# EAGLE design pixhawk (EAGLE 8.6.0)

## Sheet 1 of 2
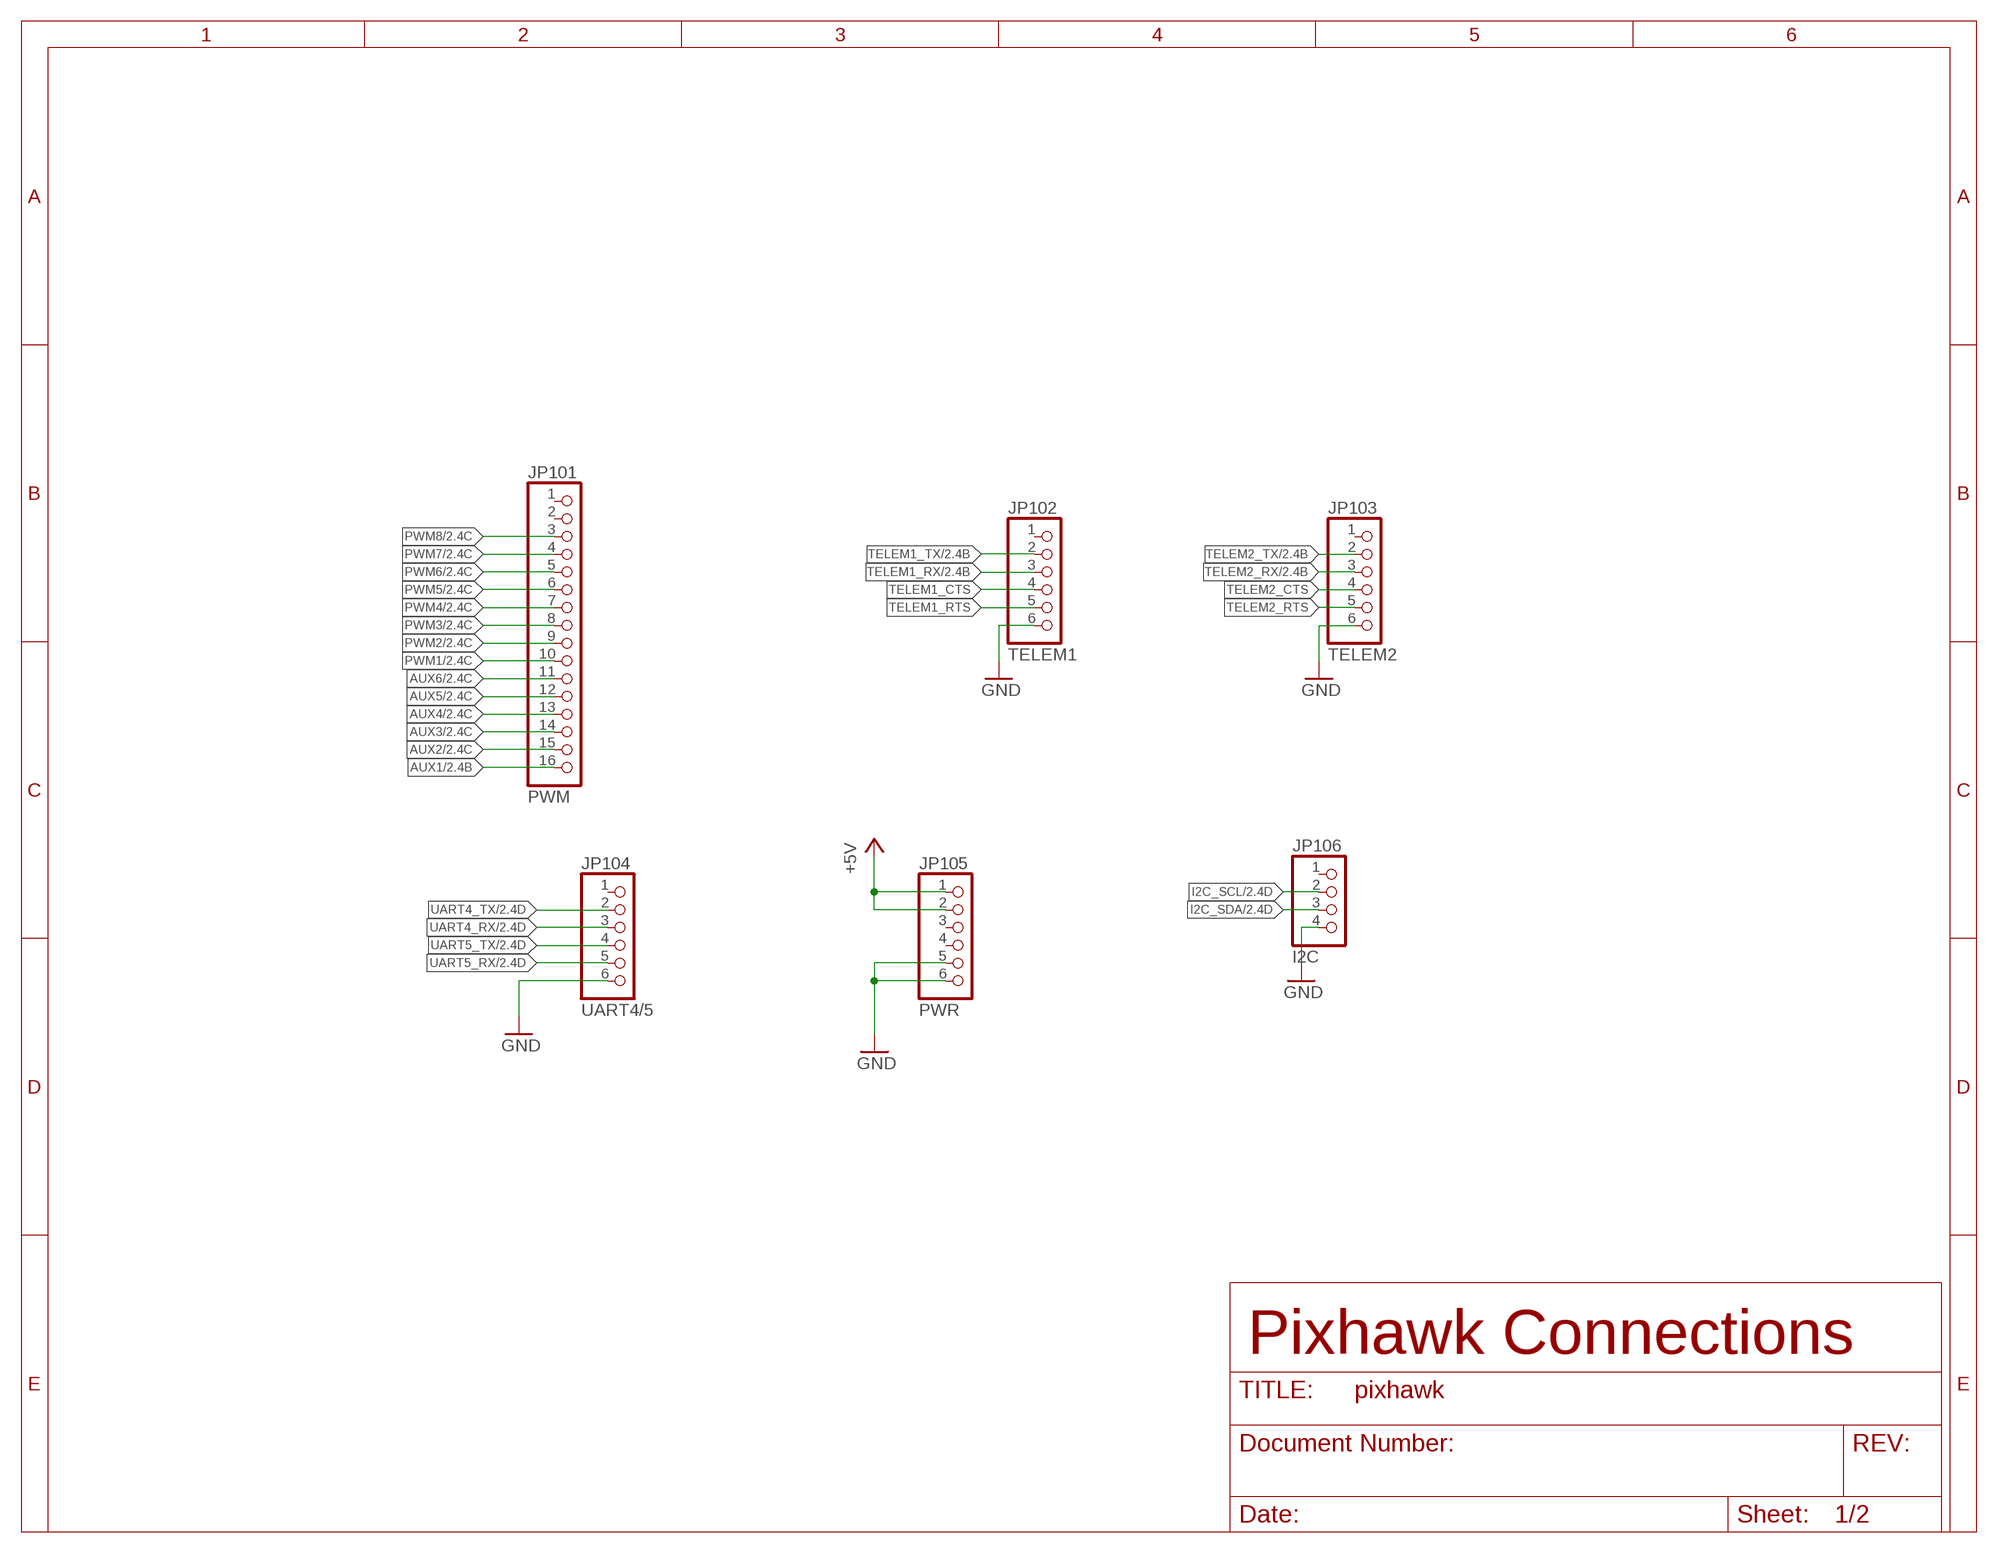
[diagram p0: schematic, sheet 1]

### Parts
JP101  PWM  PINHD-1X16  [1X16]
JP102  TELEM1  PINHD-1X6  [1X06]
JP103  TELEM2  PINHD-1X6  [1X06]
JP104  UART4/5  PINHD-1X6  [1X06]
JP105  PWR  PINHD-1X6  [1X06]
JP106  I2C  PINHD-1X4  [1X04]

### Nets
+5V: JP105.1 JP105.2 ; also sheet 2
AUX1: JP101.16 ; also sheet 2
AUX2: JP101.15 ; also sheet 2
AUX3: JP101.14 ; also sheet 2
AUX4: JP101.13 ; also sheet 2
AUX5: JP101.12 ; also sheet 2
AUX6: JP101.11 ; also sheet 2
GND: JP102.6 JP103.6 JP104.6 JP105.5 JP105.6 JP106.4 ; also sheet 2
I2C_SCL: JP106.2 ; also sheet 2
I2C_SDA: JP106.3 ; also sheet 2
PWM1: JP101.10 ; also sheet 2
PWM2: JP101.9 ; also sheet 2
PWM3: JP101.8 ; also sheet 2
PWM4: JP101.7 ; also sheet 2
PWM5: JP101.6 ; also sheet 2
PWM6: JP101.5 ; also sheet 2
PWM7: JP101.4 ; also sheet 2
PWM8: JP101.3 ; also sheet 2
TELEM1_CTS: JP102.4
TELEM1_RTS: JP102.5
TELEM1_RX: JP102.3 ; also sheet 2
TELEM1_TX: JP102.2 ; also sheet 2
TELEM2_CTS: JP103.4
TELEM2_RTS: JP103.5
TELEM2_RX: JP103.3 ; also sheet 2
TELEM2_TX: JP103.2 ; also sheet 2
UART4_RX: JP104.3 ; also sheet 2
UART4_TX: JP104.2 ; also sheet 2
UART5_RX: JP104.5 ; also sheet 2
UART5_TX: JP104.4 ; also sheet 2
Unconnected: JP101.1 JP101.2 JP102.1 JP103.1 JP104.1 JP105.3 JP105.4 JP106.1

### Notes on the sheet
- Pixhawk Connections

## Sheet 2 of 2
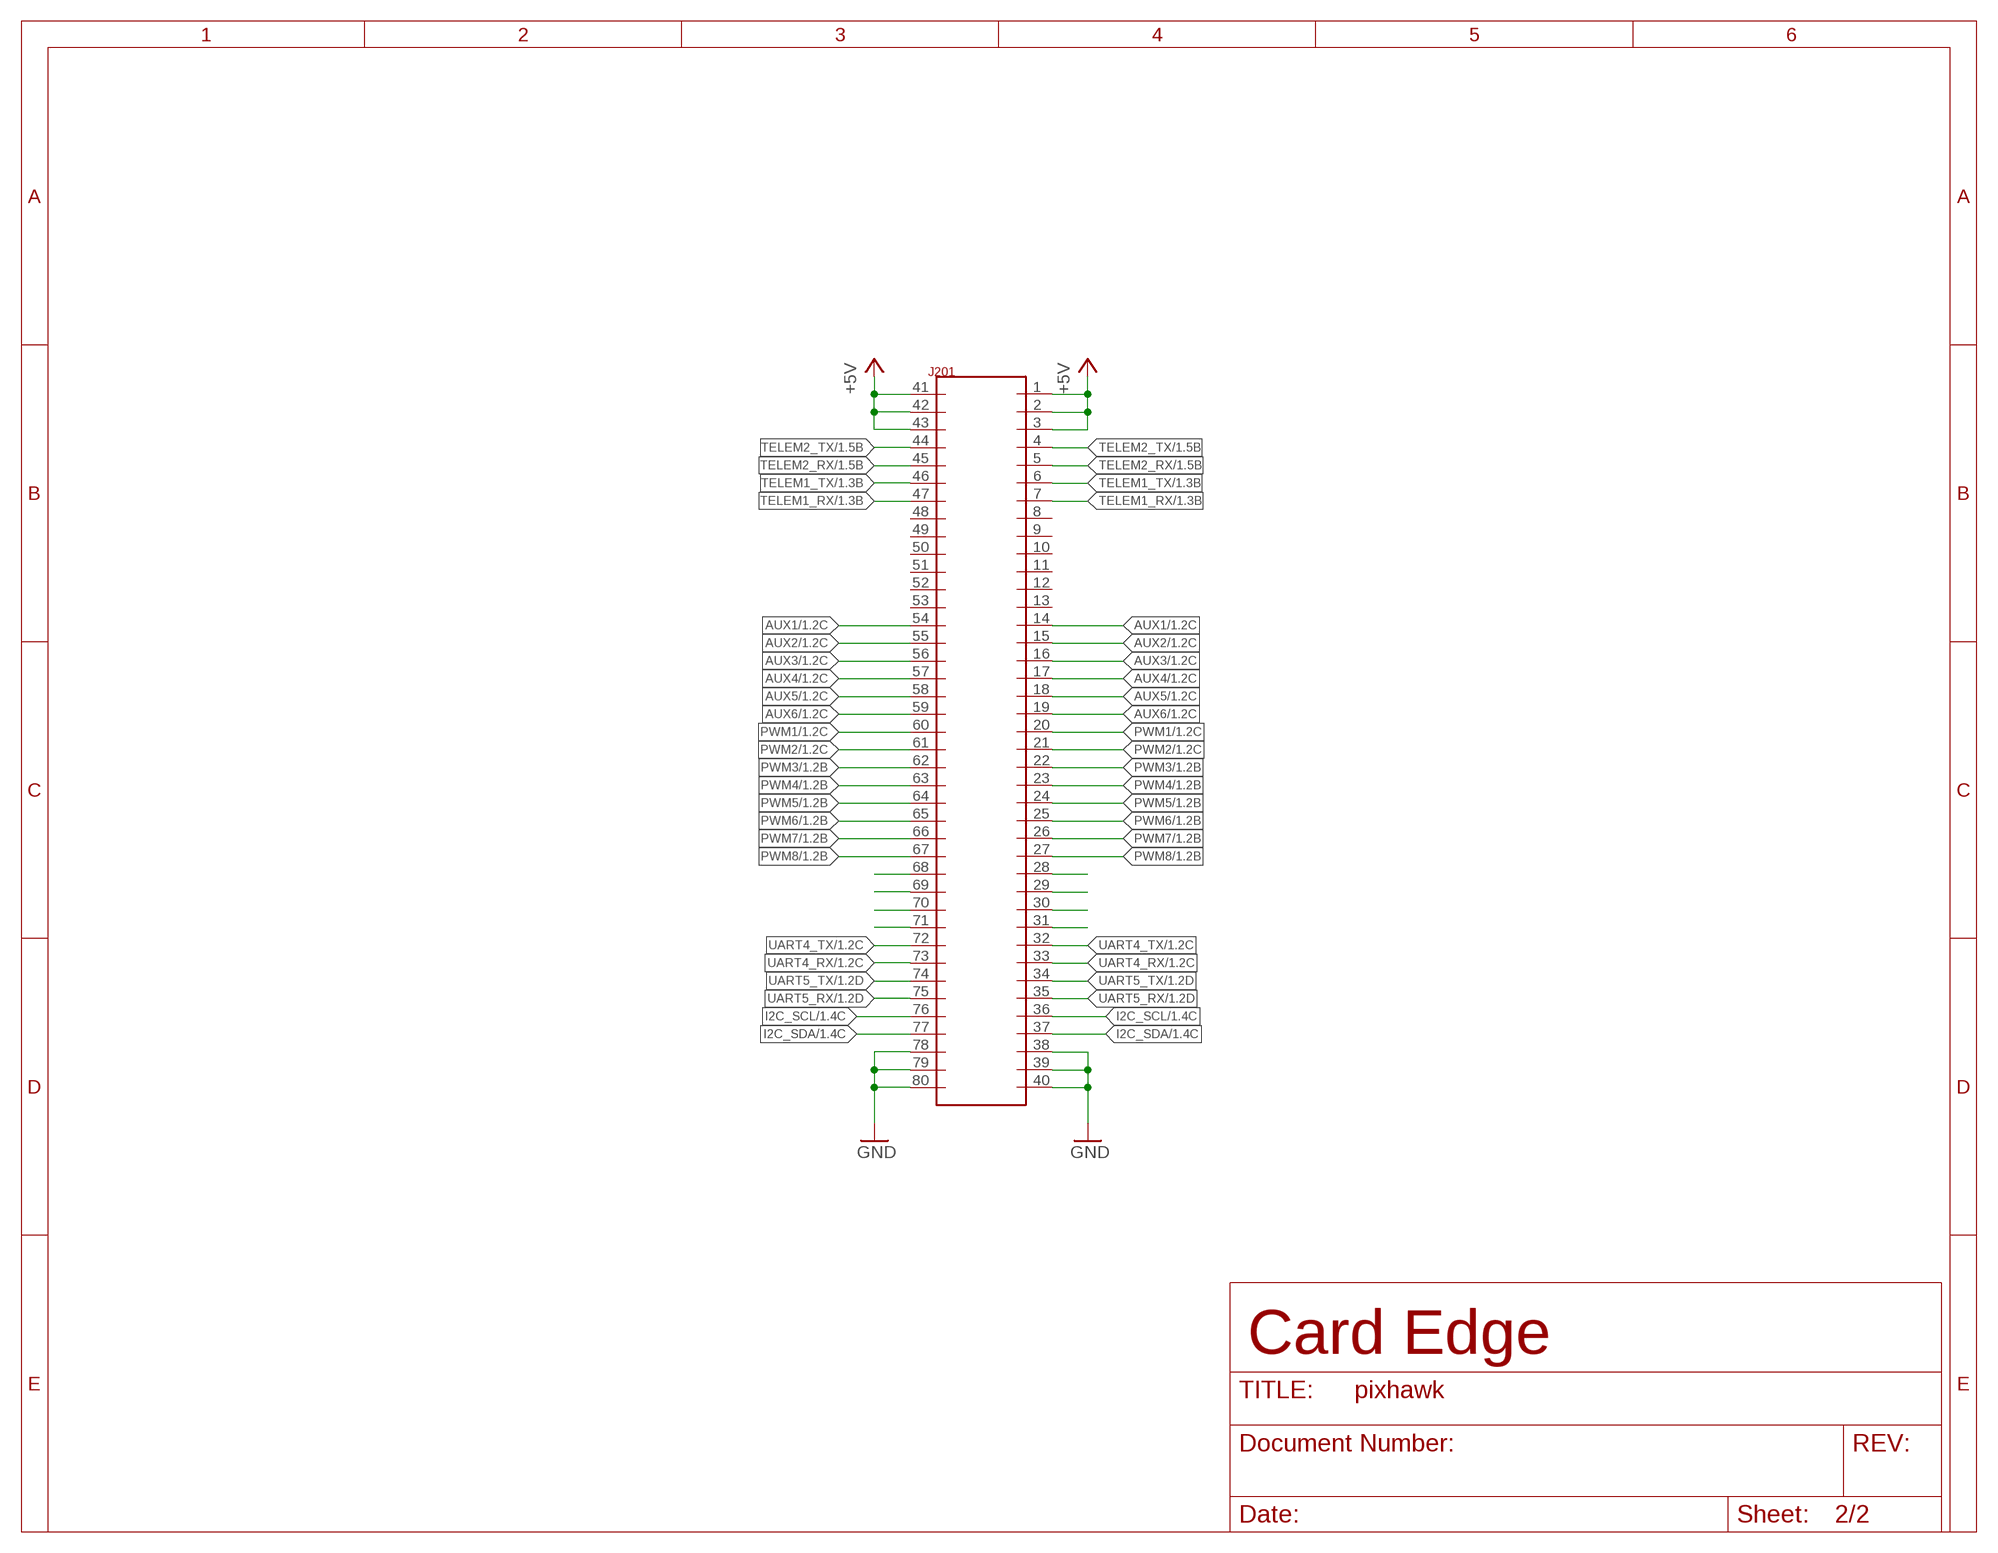
[diagram p1: schematic, sheet 2]

### Parts
J201  80-PIN-CARD-EDGE  [80-PIN-CARD-EDGE]

### Nets
+5V: J201.1 J201.2 J201.3 J201.41 J201.42 J201.43 ; also sheet 1
AUX1: J201.14 J201.54 ; also sheet 1
AUX2: J201.15 J201.55 ; also sheet 1
AUX3: J201.16 J201.56 ; also sheet 1
AUX4: J201.17 J201.57 ; also sheet 1
AUX5: J201.18 J201.58 ; also sheet 1
AUX6: J201.19 J201.59 ; also sheet 1
CAN_H: J201.30 J201.70
CAN_L: J201.31 J201.71
GND: J201.38 J201.39 J201.40 J201.78 J201.79 J201.80 ; also sheet 1
I2C_SCL: J201.36 J201.76 ; also sheet 1
I2C_SDA: J201.37 J201.77 ; also sheet 1
N$11: J201.28
N$12: J201.29
N$25: J201.69
N$26: J201.68
PWM1: J201.20 J201.60 ; also sheet 1
PWM2: J201.21 J201.61 ; also sheet 1
PWM3: J201.22 J201.62 ; also sheet 1
PWM4: J201.23 J201.63 ; also sheet 1
PWM5: J201.24 J201.64 ; also sheet 1
PWM6: J201.25 J201.65 ; also sheet 1
PWM7: J201.26 J201.66 ; also sheet 1
PWM8: J201.27 J201.67 ; also sheet 1
TELEM1_RX: J201.7 J201.47 ; also sheet 1
TELEM1_TX: J201.6 J201.46 ; also sheet 1
TELEM2_RX: J201.5 J201.45 ; also sheet 1
TELEM2_TX: J201.4 J201.44 ; also sheet 1
UART4_RX: J201.33 J201.73 ; also sheet 1
UART4_TX: J201.32 J201.72 ; also sheet 1
UART5_RX: J201.35 J201.75 ; also sheet 1
UART5_TX: J201.34 J201.74 ; also sheet 1
Unconnected: J201.8 J201.9 J201.10 J201.11 J201.12 J201.13 J201.48 J201.49 J201.50 J201.51 J201.52 J201.53

### Notes on the sheet
- Card Edge

## Library data of the parts
J201 = auv:80-PIN-CARD-EDGE
JP101 = auv:PINHD-1X16: PIN HEADER
JP102-JP105 = auv:PINHD-1X6: PIN HEADER
JP106 = auv:PINHD-1X4: PIN HEADER

## Board
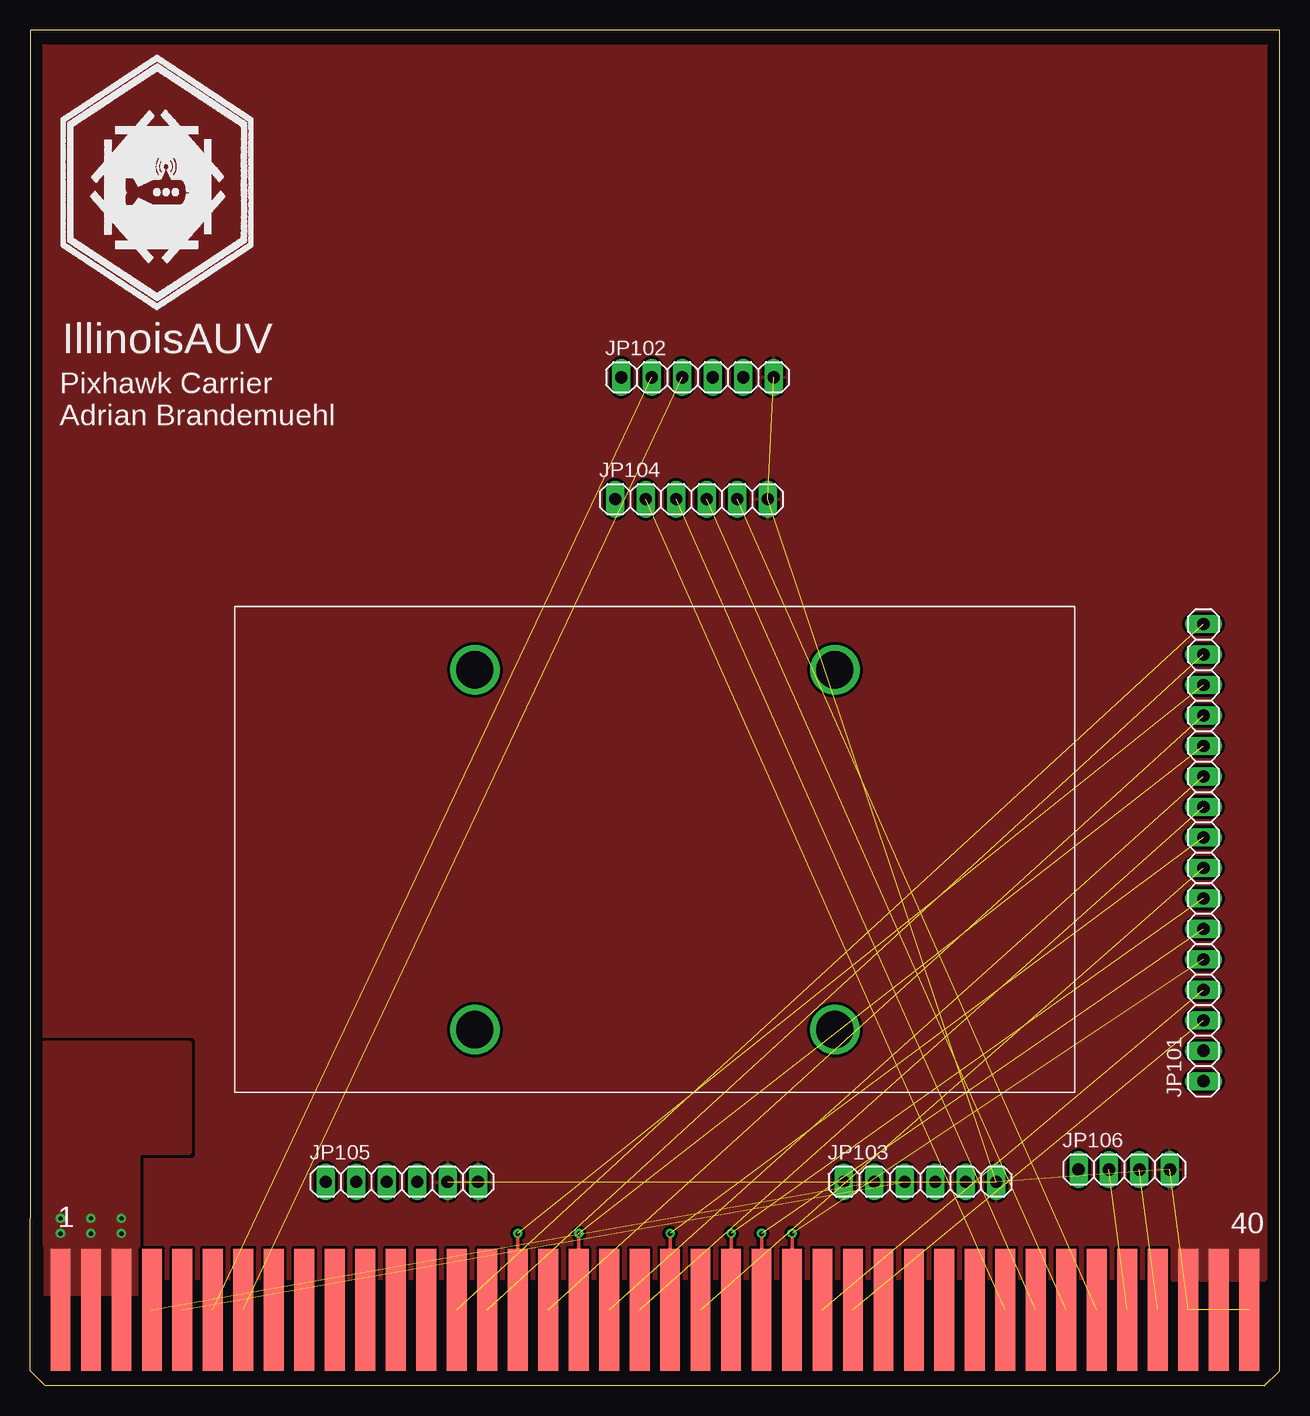
[diagram p2: board, top side]
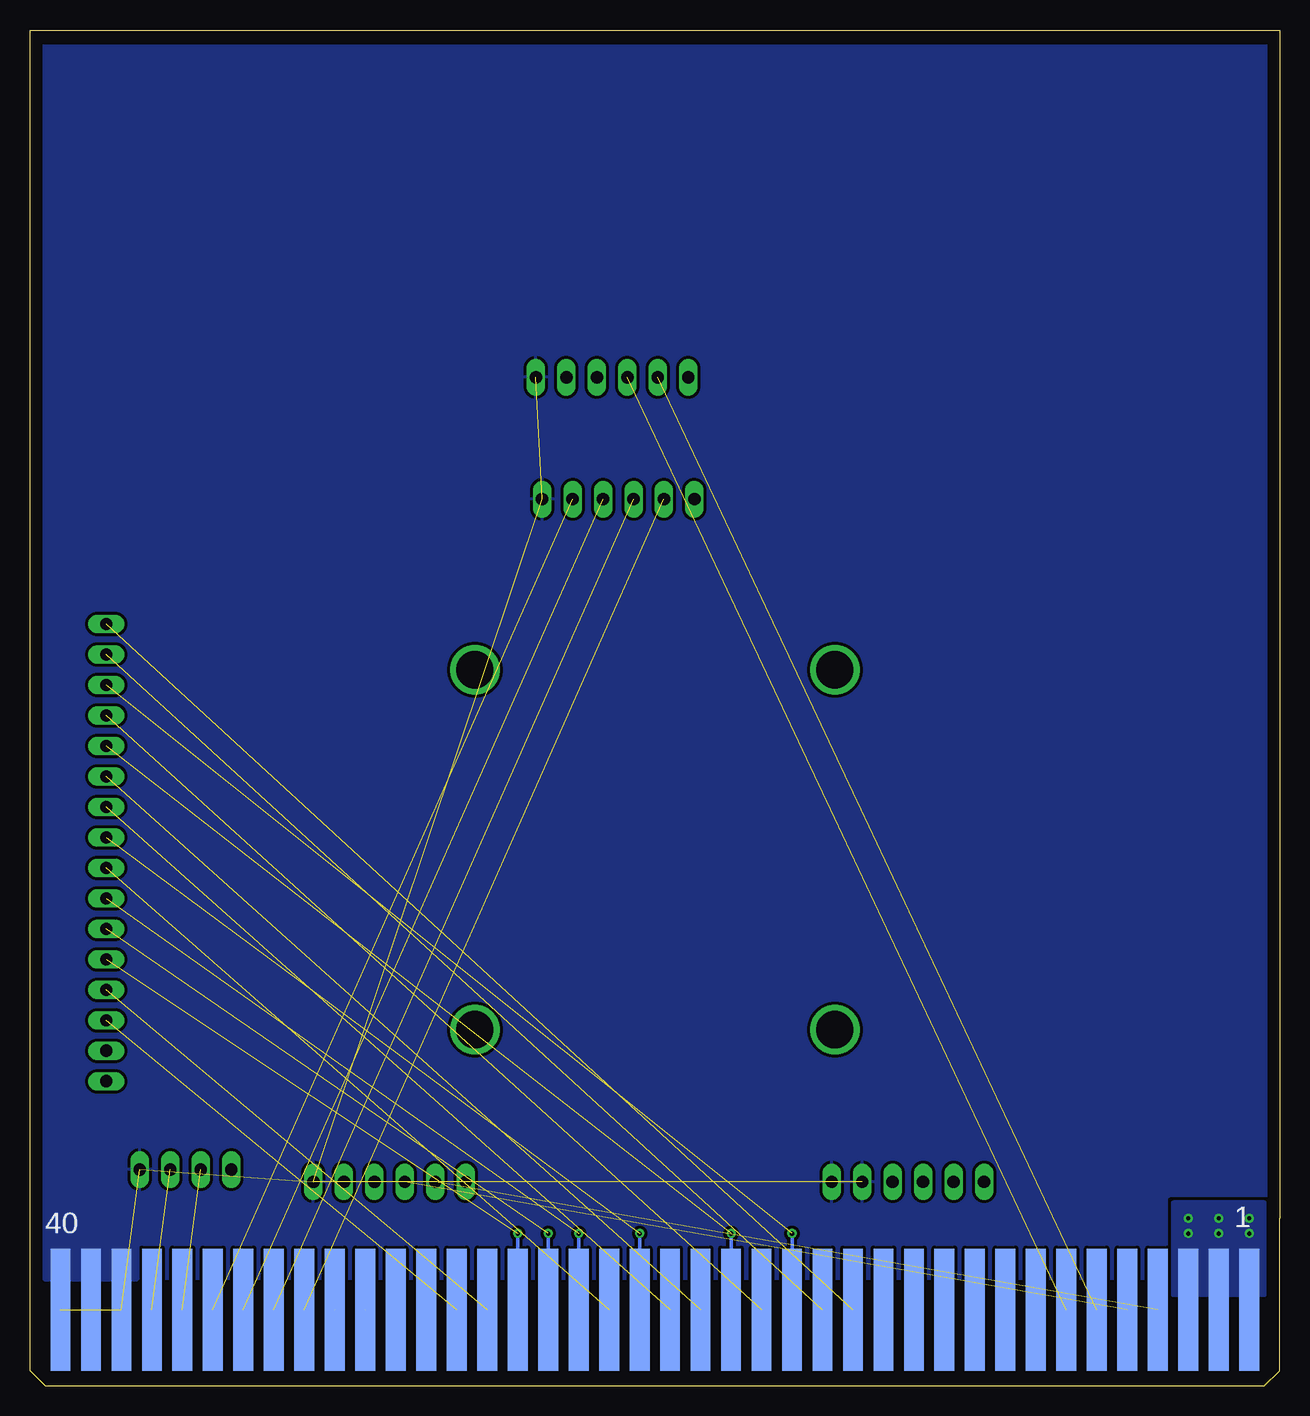
[diagram p3: board, bottom side, seen from below]

Size 104.14 x 113.03 mm. Coordinates in mm from the lower left corner, seen from the top.
Outline: 104.14,13.97 104.14,113.03 0,113.03 0,13.97
Copper layers (1*16): Top 0.035mm / dielectric 1.5mm / Bottom 0.035mm
Design rules "PCBway": minimum track width 6mil, minimum drill 0.3mm, track to track 0.205mm, track to pad 0.205mm, pad to pad 0.205mm, via to via 0.205mm, smd to smd 8mil, copper to edge 40mil, drill to drill 8mil, minimum pad ring 10mil, minimum via ring 8mil, stop-mask expansion 4mil, vias tented up to drill 25mil, thermal gap 10mil

### Footprints (pad centres in the part's own frame; a part is rotated, then mirrored left to right if it is on the bottom)
80-PIN-CARD-EDGE = smd 1.651 x 10.16: 1 -49.53,0; 2 -46.99,0; 3 -44.45,0; 4 -41.91,0; 5 -39.37,0; 6 -36.83,0; 7 -34.29,0; 8 -31.75,0; 9 -29.21,0; 10 -26.67,0; 11 -24.13,0; 12 -21.59,0; 13 -19.05,0; 14 -16.51,0; 15 -13.97,0; 16 -11.43,0; 17 -8.89,0; 18 -6.35,0; 19 -3.81,0; 20 -1.27,0; 21 1.27,0; 22 3.81,0; 23 6.35,0; 24 8.89,0; 25 11.43,0; 26 13.97,0; 27 16.51,0; 28 19.05,0; 29 21.59,0; 30 24.13,0; 31 26.67,0; 32 29.21,0; 33 31.75,0; 34 34.29,0; 35 36.83,0; 36 39.37,0; 37 41.91,0; 38 44.45,0; 39 46.99,0; 40 49.53,0 | smd 1.651 x 10.16 bottom: 41 -49.53,0; 42 -46.99,0; 43 -44.45,0; 44 -41.91,0; 45 -39.37,0; 46 -36.83,0; 47 -34.29,0; 48 -31.75,0; 49 -29.21,0; 50 -26.67,0; 51 -24.13,0; 52 -21.59,0; 53 -19.05,0; 54 -16.51,0; 55 -13.97,0; 56 -11.43,0; 57 -8.89,0; 58 -6.35,0; 59 -3.81,0; 60 -1.27,0; 61 1.27,0; 62 3.81,0; 63 6.35,0; 64 8.89,0; 65 11.43,0; 66 13.97,0; 67 16.51,0; 68 19.05,0; 69 21.59,0; 70 24.13,0; 71 26.67,0; 72 29.21,0; 73 31.75,0; 74 34.29,0; 75 36.83,0; 76 39.37,0; 77 41.91,0; 78 44.45,0; 79 46.99,0; 80 49.53,0
1X16 = drill 1.016 long: 1 -19.05,0; 2 -16.51,0; 3 -13.97,0; 4 -11.43,0; 5 -8.89,0; 6 -6.35,0; 7 -3.81,0; 8 -1.27,0; 9 1.27,0; 10 3.81,0; 11 6.35,0; 12 8.89,0; 13 11.43,0; 14 13.97,0; 15 16.51,0; 16 19.05,0
1X06 = drill 1.016 long: 1 -6.35,0; 2 -3.81,0; 3 -1.27,0; 4 1.27,0; 5 3.81,0; 6 6.35,0
1X04 = drill 1.016 long: 1 -3.81,0; 2 -1.27,0; 3 1.27,0; 4 3.81,0
PIXHAWK_MOUNTING_HOLES = drill 3.1: P$1 -15,-15; P$2 -15,15; P$3 15,15; P$4 15,-15

### Placement (x,y rotation side)
J201  52.07,6.35 0 top
JP101  97.79,44.45 90 top
JP102  55.63,84.07 0 top
JP103  74.17,17.02 0 top
JP104  55.12,73.91 0 top
JP105  30.99,17.02 0 top
JP106  91.19,18.03 0 top
U$1  PIXHAWK_MOUNTING_HOLES  [PIXHAWK_MOUNTING_HOLES]  52.07,44.7 180 top
U$2  ILLINOISAUV  [ILLINOISAUV]  11.56,98.76 0 top

### Tracks (layer width: path | path; a pad name or v marks a point on that pad's centre or on a via)
+5V  (via drill 0.35)
  other vias: 2.54,13.97 2.54,12.7 5.08,12.7 5.08,13.97 7.62,13.97 7.62,12.7
  pour Bottom (rank 5, no thermals): 1.27,15.24 8.89,15.24 8.89,7.62 1.27,7.62
  pour Top (no thermals): 1.27,15.24 8.89,15.24 8.89,7.62 1.27,7.62
  pour Top: 13.21,28.45 1.27,28.45 1.27,7.62 8.89,7.62 8.89,19.56 13.21,19.56
AUX1  (2 unrouted)
AUX2  (2 unrouted)
AUX3  (via drill 0.35)  (1 unrouted)
  Top 0.305: J201.56 v40.64,12.7
  Bottom 0.305: J201.56 v40.64,12.7
AUX4  (2 unrouted)
AUX5  (via drill 0.35)  (1 unrouted)
  Top 0.305: J201.58 v45.72,12.7
  Bottom 0.305: J201.58 v45.72,12.7
AUX6  (2 unrouted)
CAN_H  (1 unrouted)
CAN_L  (1 unrouted)
GND  (11 unrouted)
  pour Top (isolate 0.254, rank 6): 0,111.76 104.14,111.76 104.14,8.89 0,8.89
  pour Top (no thermals): 95.25,13.97 102.87,13.97 102.87,8.89 95.25,8.89
  pour Bottom (no thermals): 102.87,13.97 95.25,13.97 95.25,8.89 102.87,8.89
  pour Bottom (isolate 0.254, rank 6): 104.14,111.76 0,111.76 0,8.89 104.14,8.89
I2C_SCL  (2 unrouted)
I2C_SDA  (2 unrouted)
PWM1  (2 unrouted)
PWM2  (via drill 0.35)  (1 unrouted)
  Top 0.305: v53.34,12.7 J201.61
  Bottom 0.305: J201.61 v53.34,12.7
PWM3  (2 unrouted)
PWM4  (via drill 0.35)  (1 unrouted)
  Top 0.305: v58.42,12.7 J201.63
  Bottom 0.305: J201.63 v58.42,12.7
PWM5  (via drill 0.35)  (1 unrouted)
  Top 0.305: J201.64 v60.96,12.7
  Bottom 0.305: J201.64 v60.96,12.7
PWM6  (via drill 0.35)  (1 unrouted)
  Top 0.305: v63.5,12.7 J201.65
  Bottom 0.305: J201.65 v63.5,12.7
PWM7  (2 unrouted)
PWM8  (2 unrouted)
TELEM1_RX  (2 unrouted)
TELEM1_TX  (2 unrouted)
TELEM2_RX  (2 unrouted)
TELEM2_TX  (2 unrouted)
UART4_RX  (2 unrouted)
UART4_TX  (2 unrouted)
UART5_RX  (2 unrouted)
UART5_TX  (2 unrouted)

### Text on the board
tNames: Pixhawk Carrier / Adrian Brandemuehl | 1 | 40
bNames: 1 | 40